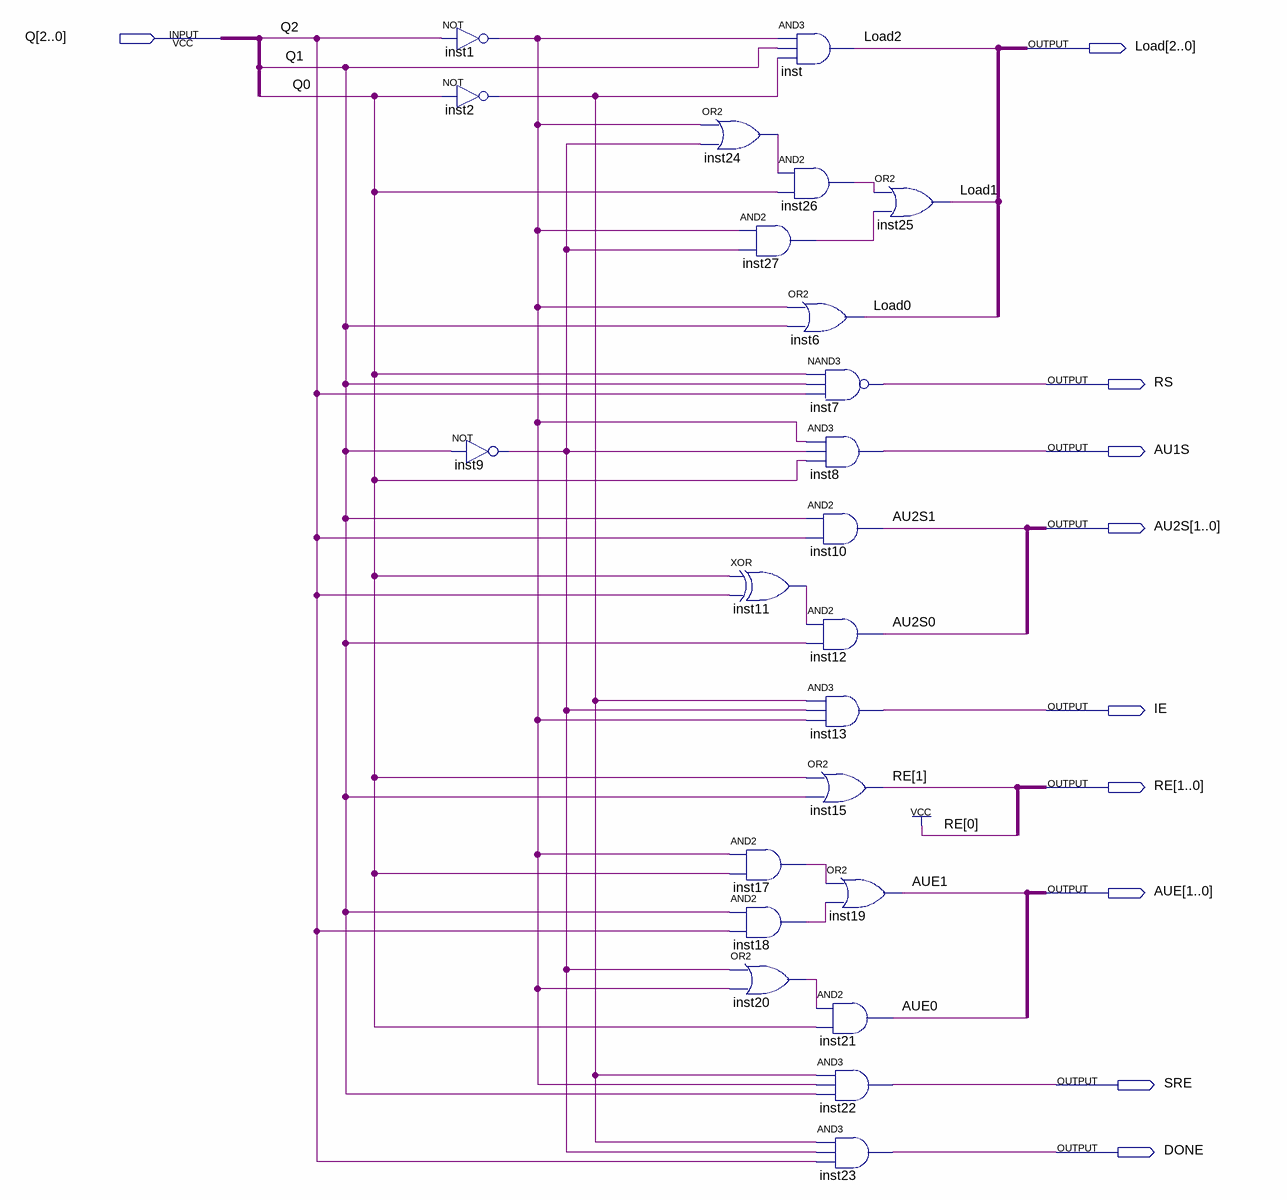
[diagram p0: schematic sheet]
// Quartus schematic OutputLogic.bdf as structural Verilog: 23 symbols, 10 pins
module OutputLogic (
  input  [2:0] Q,
  output [2:0] Load,
  output RS,
  output AU1S,
  output [1:0] AU2S,
  output IE,
  output [1:0] RE,
  output [1:0] AUE,
  output SRE,
  output DONE
);

  wire inst1_out, inst2_out, inst9_out, inst11_out, inst17_out, inst18_out, inst20_out, inst24_out,
       inst26_out, inst27_out;

  not inst1 (inst1_out, Q[2]);
  not inst2 (inst2_out, Q[0]);
  not inst9 (inst9_out, Q[1]);
  or inst24 (inst24_out, inst1_out, inst9_out);
  and inst27 (inst27_out, inst1_out, inst9_out);
  xor inst11 (inst11_out, Q[0], Q[2]);
  and inst17 (inst17_out, inst1_out, Q[0]);
  and inst18 (inst18_out, Q[1], Q[2]);
  or inst20 (inst20_out, inst9_out, inst1_out);
  and inst (Load[2], inst1_out, Q[1], inst2_out);
  and inst26 (inst26_out, inst24_out, Q[0]);
  or inst6 (Load[0], inst1_out, Q[1]);
  nand inst7 (RS, Q[0], Q[1], Q[2]);
  and inst8 (AU1S, inst1_out, inst9_out, Q[0]);
  and inst10 (AU2S[1], Q[1], Q[2]);
  and inst12 (AU2S[0], inst11_out, Q[1]);
  and inst13 (IE, inst2_out, inst9_out, inst1_out);
  or inst15 (RE[1], Q[0], Q[1]);
  and inst21 (AUE[0], inst20_out, Q[0]);
  and inst22 (SRE, inst2_out, inst1_out, Q[1]);
  and inst23 (DONE, inst2_out, inst9_out, Q[2]);
  or inst25 (Load[1], inst26_out, inst27_out);
  or inst19 (AUE[1], inst17_out, inst18_out);

  assign RE[0] = 1'b1;
endmodule
